# Altium schematic sheet Radar_Digital.SchDoc: Radar - Digital Board
size A3; Date: 21 / 12 / 2025; CheckedBy: João Bortolace; Author: João Bortolace; DrawnBy: João Bortolace; Engineer: João Bortolace; DocumentNumber: *1; Revision: 1.1; SheetNumber: 1; SheetTotal: 1
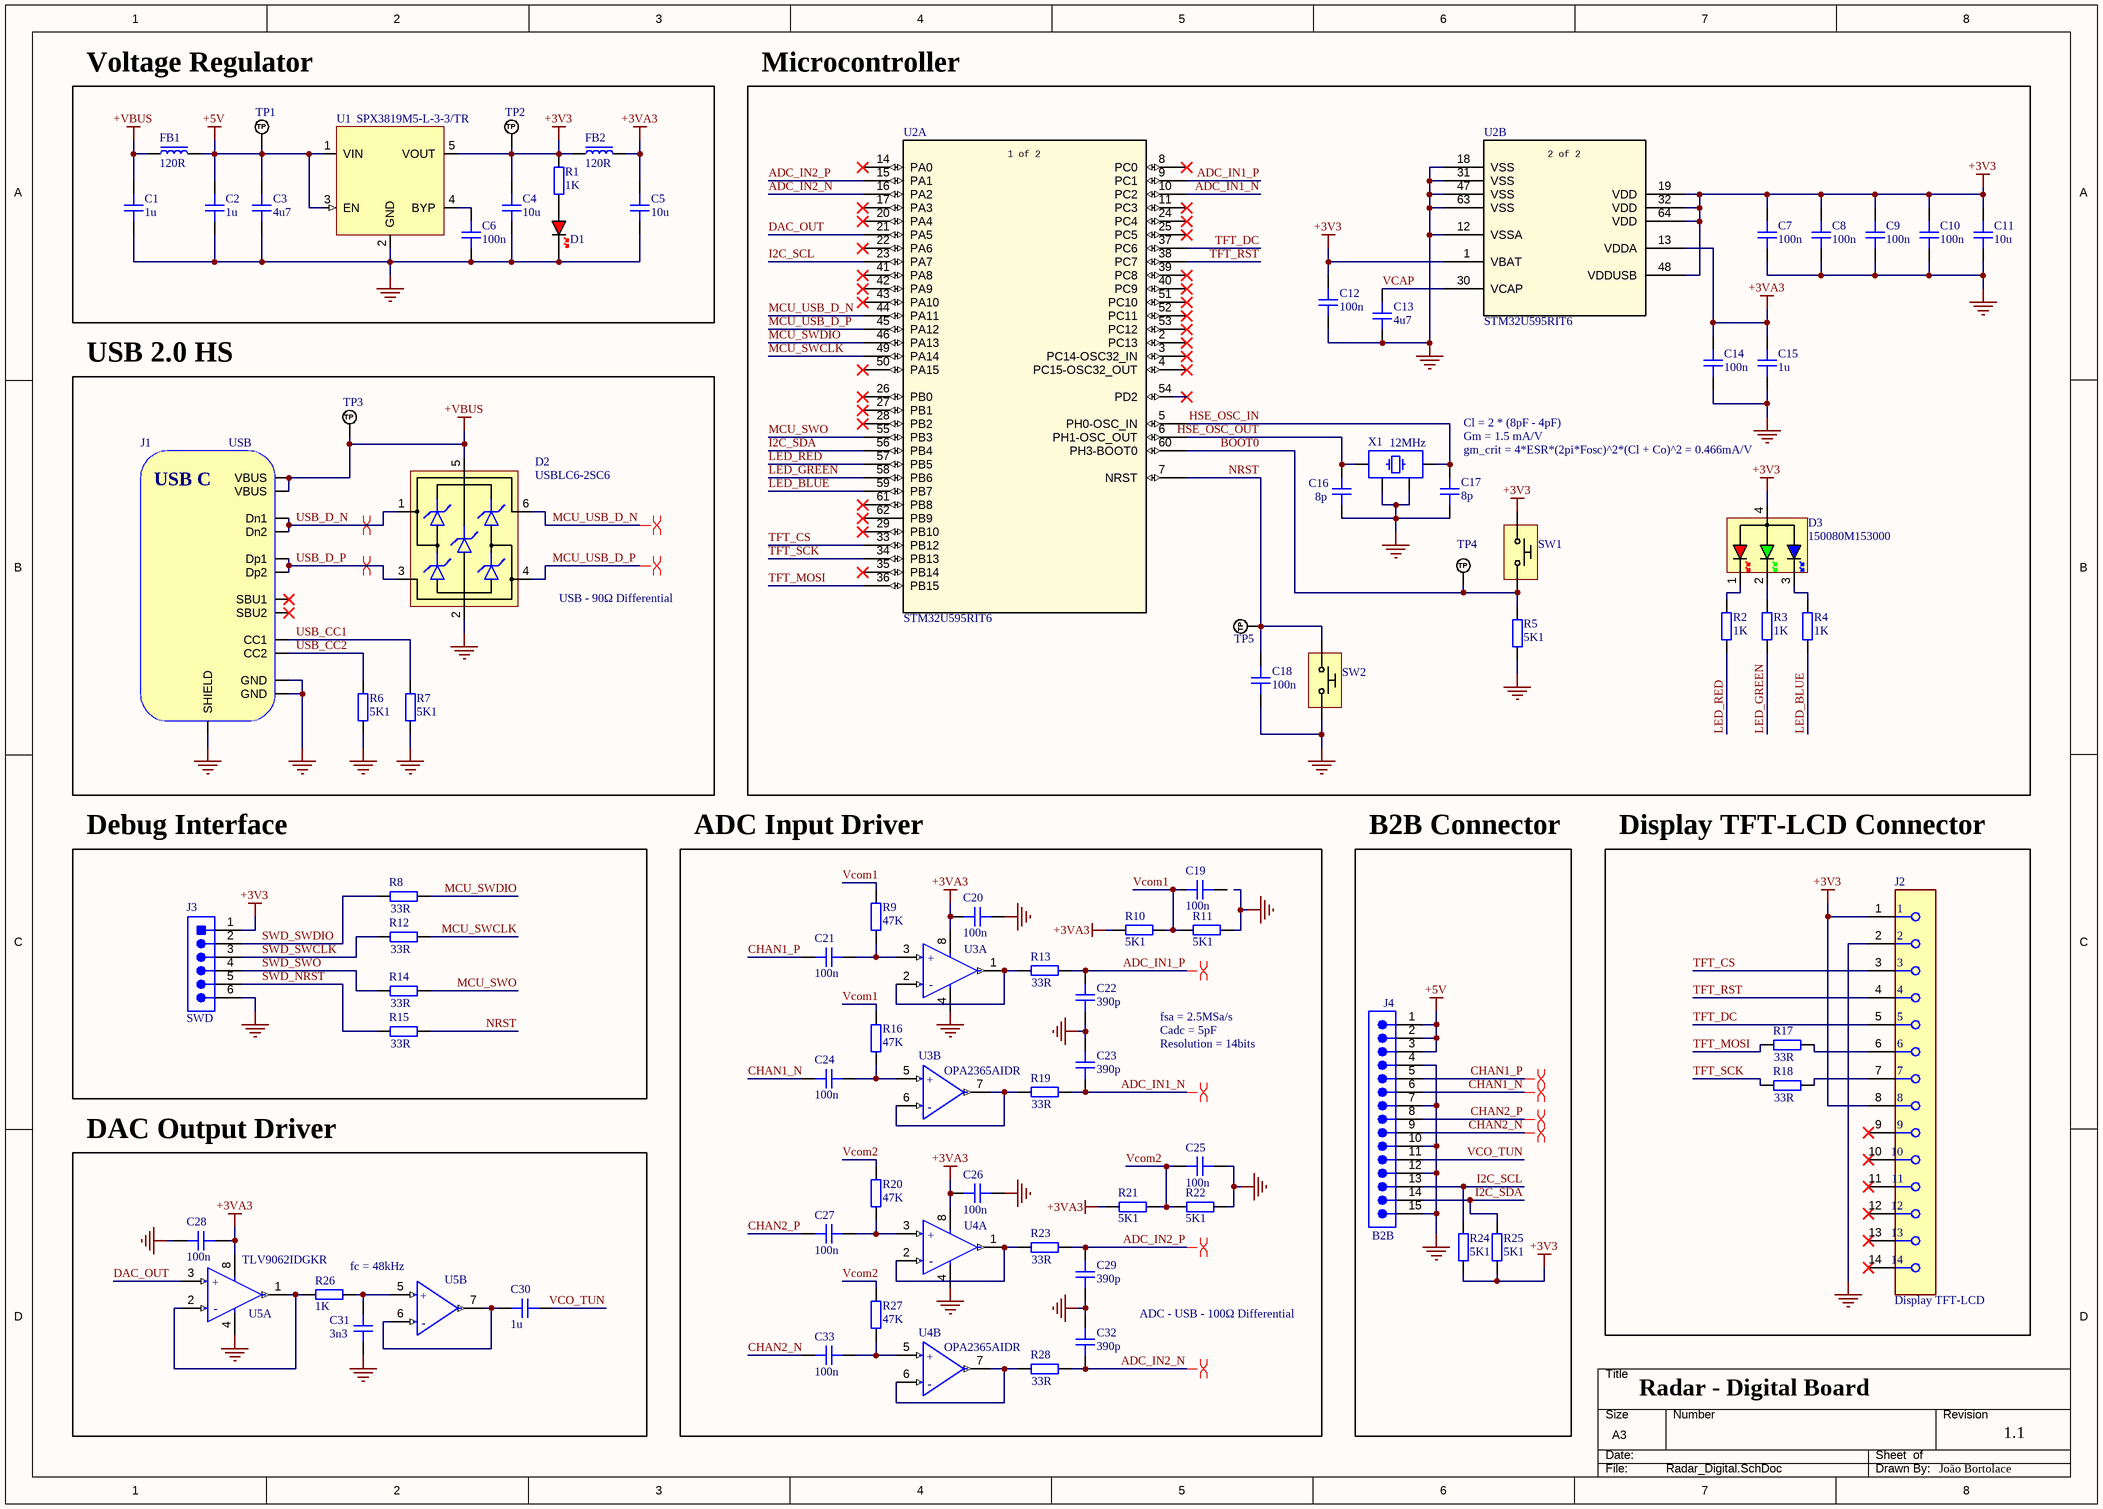
[diagram p0: Radar_Digital.SchDoc]

## Parts
C1  1u  [CAP_0603]
C2  1u  [CAP_0603]
C3  4u7  [CAP_0603]
C4  10u  [CAP_0805]
C5  10u  [CAP_0805]
C6  100n  [CAP_0603]
C7  100n  [CAP_0603]
C8  100n  [CAP_0603]
C9  100n  [CAP_0603]
C10  100n  [CAP_0603]
C11  10u  [CAP_0805]
C12  100n  [CAP_0603]
C13  4u7  [CAP_0603]
C14  100n  [CAP_0603]
C15  1u  [CAP_0603]
C16  8p  [CAP_0603]
C17  8p  [CAP_0603]
C18  100n  [CAP_0603]
C19  100n  [CAP_0603]
C20  100n  [CAP_0603]
C21  100n  [CAP_0603]
C22  390p  [CAP_0603]
C23  390p  [CAP_0603]
C24  100n  [CAP_0603]
C25  100n  [CAP_0603]
C26  100n  [CAP_0603]
C27  100n  [CAP_0603]
C28  100n  [CAP_0603]
C29  390p  [CAP_0603]
C30  1u  [CAP_0603]
C31  3n3  [CAP_0603]
C32  390p  [CAP_0603]
C33  100n  [CAP_0603]
D1  ON  [LED_0603_RED]  (value not drawn)
D2  USBLC6-2SC6  [SOT-23-6]
D3  150080M153000  [150080M153000]
FB1  120R  [FB_0603]
FB2  120R  [FB_0603]
J1  USB  [USB4105-GF-A-060]
J2  Display TFT-LCD  [FP-SSQ-114-01-G-S-MFG]  (no BOM)
J3  SWD  [SMTC-TSW-106-07-S-S_V]  (no BOM)
J4  B2B  [61301511121]  (no BOM)
R1  1K  [RES_0603]
R2  1K  [RES_0603]
R3  1K  [RES_0603]
R4  1K  [RES_0603]
R5  5K1  [RES_0603]
R6  5K1  [RES_0603]
R7  5K1  [RES_0603]
R8  33R  [RES_0603]
R9  47K  [RES_0603]
R10  5K1  [RES_0603]
R11  5K1  [RES_0603]
R12  33R  [RES_0603]
R13  33R  [RES_0603]
R14  33R  [RES_0603]
R15  33R  [RES_0603]
R16  47K  [RES_0603]
R17  33R  [RES_0603]
R18  33R  [RES_0603]
R19  33R  [RES_0603]
R20  47K  [RES_0603]
R21  5K1  [RES_0603]
R22  5K1  [RES_0603]
R23  33R  [RES_0603]
R24  5K1  [RES_0603]
R25  5K1  [RES_0603]
R26  1K  [RES_0603]
R27  47K  [RES_0603]
R28  33R  [RES_0603]
SW1  BOOT  [PTS815]  (value not drawn)
SW2  RST  [PTS815]  (value not drawn)
TP1  TP_NOBOM  [PAD_RND_1MM]  (value not drawn)  (no BOM)
TP2  TP_NOBOM  [PAD_RND_1MM]  (value not drawn)  (no BOM)
TP3  TP_NOBOM  [PAD_RND_1MM]  (value not drawn)  (no BOM)
TP4  TP_NOBOM  [PAD_RND_1MM]  (value not drawn)  (no BOM)
TP5  TP_NOBOM  [PAD_RND_1MM]  (value not drawn)  (no BOM)
U1  SPX3819M5-L-3-3/TR  [SOT-23-5]
U2  STM32U595RIT6  [LQFP64-10x10mm_STM]  (parts A,B of 2)
U3  OPA2365AIDR  [FP-D0008A-MFG]  (value not drawn)  (parts A,B of 2)
U4  OPA2365AIDR  [FP-D0008A-MFG]  (value not drawn)  (parts A,B of 2)
U5  TLV9062IDGKR  [FP-DGK0008A-IPC_A]  (parts A,B of 2)
X1  12MHz  [XTAL_3225]

## Blocks framed on the sheet
Voltage Regulator: C1-C6 D1 FB1 FB2 R1 TP1 TP2 U1
Microcontroller: C7-C18 D3 R2-R5 SW1 SW2 TP4 TP5 U2 X1
USB 2.0 HS: D2 J1 R6 R7 TP3
Debug Interface: J3 R8 R12 R14 R15
ADC Input Driver: C19-C27 C29 C32 C33 R9-R11 R13 R16 R19-R23 R27 R28 U3 U4
B2B Connector: J4 R24 R25
Display TFT-LCD Connector: J2 R17 R18
DAC Output Driver: C28 C30 C31 R26 U5

## Nets
+3V3: C4.2 C7.2 C8.2 C9.2 C10.2 C11.2 C12.2 D3.4(AC) FB2.1 J2.1 J2.8 J3.1 R1.1 R24.1 R25.1 SW1.1 TP2.1(TP) U1.5(VOUT) U2.1(VBAT) U2.19(VDD) U2.32(VDD) U2.48(VDDUSB) U2.64(VDD)
+3VA3: C5.2 C14.2 C15.2 C20.2 C26.2 C28.2 FB2.2 R10.2 R21.2 U2.13(VDDA) U3.8(V+) U4.8(V+) U5.8(V+)
+5V: C2.2 C3.2 FB1.2 J4.1 J4.2 J4.3 TP1.1(TP) U1.1(VIN) U1.3(EN)
+VBUS: C1.2 D2.5(VBUS) FB1.1 J1.A4B9(VBUS) J1.B4A9(VBUS) TP3.1(TP)
GND: C1.1 C2.1 C3.1 C4.1 C5.1 C6.1 C7.1 C8.1 C9.1 C10.1 C11.1 C12.1 C13.1 C14.1 C15.1 C16.1 C17.1 C18.1 C20.1 C22.1 C23.2 C25.1 C26.1 C28.1 C29.1 C31.1 C32.2 D1.K D2.2(GND) J1.A1B12(GND) J1.B1A12(GND) J1.SH(SHIELD) J2.2 J3.6 J4.4 J4.7 J4.10 J4.12 J4.15 R5.1 R6.1 R7.1 R11.1 R22.1 SW2.2 U1.2(GND) U2.12(VSSA) U2.18(VSS) U2.31(VSS) U2.47(VSS) U2.63(VSS) U3.4(V-) U4.4(V-) U5.4(V-) X1.2 X1.4
ADC_IN1_N: C23.1 R19.2 U2.10(PC2)
ADC_IN1_P: C22.2 R13.2 U2.9(PC1)
ADC_IN2_N: C32.1 R28.2 U2.16(PA2)
ADC_IN2_P: C29.2 R23.2 U2.15(PA1)
BOOT0: R5.2 SW1.2 TP4.1(TP) U2.60(PH3-BOOT0)
CHAN1_N: C24.2 J4.6
CHAN1_P: C21.2 J4.5
CHAN2_N: C33.2 J4.9
CHAN2_P: C27.2 J4.8
DAC_OUT: U2.21(PA5) U5.3(IN1+)
HSE_OSC_IN: C17.2 U2.5(PH0-OSC_IN) X1.3
HSE_OSC_OUT: C16.2 U2.6(PH1-OSC_OUT) X1.1
I2C_SCL: J4.13 R24.2 U2.23(PA7)
I2C_SDA: J4.14 R25.2 U2.56(PB4)
LED_BLUE: R4.2 U2.59(PB7)
LED_GREEN: R3.2 U2.58(PB6)
LED_RED: R2.2 U2.57(PB5)
MCU_SWCLK: R12.2 U2.49(PA14)
MCU_SWDIO: R8.2 U2.46(PA13)
MCU_SWO: R14.2 U2.55(PB3)
MCU_USB_D_N: D2.6(IO1) U2.44(PA11)
MCU_USB_D_P: D2.4(IO2) U2.45(PA12)
NRST: C18.2 R15.2 SW2.1 TP5.1(TP) U2.7(NRST)
SWD_NRST: J3.5 R15.1
SWD_SWCLK: J3.3 R12.1
SWD_SWDIO: J3.2 R8.1
SWD_SWO: J3.4 R14.1
TFT_CS: J2.3 U2.33(PB12)
TFT_DC: J2.5 U2.37(PC6)
TFT_MOSI: R17.1 U2.36(PB15)
TFT_RST: J2.4 U2.38(PC7)
TFT_SCK: R18.1 U2.34(PB13)
USB_CC1: J1.A5(CC1) R7.2
USB_CC2: J1.B5(CC2) R6.2
USB_D_N: D2.1(IO1) J1.A7(Dn1) J1.B7(Dn2)
USB_D_P: D2.3(IO2) J1.A6(Dp1) J1.B6(Dp2)
VCAP: C13.2 U2.30(VCAP)
VCO_TUN: C30.1 J4.11
Vcom1: C19.2 R9.2 R10.1 R11.2 R16.2
Vcom2: C25.2 R20.2 R21.1 R22.2 R27.2
NetC6_2: C6.2 U1.4(BYP)
NetC21_1: C21.1 R9.1 U3.3(IN_A+)
NetC24_1: C24.1 R16.1 U3.5(IN_B+)
NetC27_1: C27.1 R20.1 U4.3(IN_A+)
NetC30_2: C30.2 U5.6(IN2-) U5.7(OUT2)
NetC31_2: C31.2 R26.2 U5.5(IN2+)
NetC33_1: C33.1 R27.1 U4.5(IN_B+)
NetD1_A: D1.A R1.2
NetD3_1: D3.1(CR) R2.1
NetD3_2: D3.2(CG) R3.1
NetD3_3: D3.3(CB) R4.1
NetJ2_6: J2.6 R17.2
NetJ2_7: J2.7 R18.2
NetR13_1: R13.1 U3.1(VOUTA) U3.2(IN_A-)
NetR19_1: R19.1 U3.6(IN_B-) U3.7(VOUTB)
NetR23_1: R23.1 U4.1(VOUTA) U4.2(IN_A-)
NetR26_1: R26.1 U5.1(OUT1) U5.2(IN1-)
NetR28_1: R28.1 U4.6(IN_B-) U4.7(VOUTB)

Not connected (* = marked no-connect by the designer): C19 1; J1 A8(SBU1)* B8(SBU2)*; J2 9* 10* 11* 12* 13* 14*; U2 2(PC13)* 3(PC14-OSC32_IN)* 4(PC15-OSC32_OUT)* 8(PC0)* 11(PC3)* 14(PA0)* 17(PA3)* 20(PA4)* 22(PA6)* 24(PC4)* 25(PC5)* 26(PB0)* 27(PB1)* 28(PB2)* 29(PB10)* 35(PB14)* 39(PC8)* 40(PC9)* 41(PA8)* 42(PA9)* 43(PA10)* 50(PA15)* 51(PC10)* 52(PC11)* 53(PC12)* 54(PD2)* 61(PB8)* 62(PB9)*

## Layout directives
differential pair; net class USB_DIFF: MCU_USB_D_N, MCU_USB_D_P, USB_D_N, USB_D_P
differential pair; net class ADC_DIFF: ADC_IN1_N, ADC_IN1_P, ADC_IN2_N, ADC_IN2_P, CHAN1_N, CHAN1_P, CHAN2_N, CHAN2_P

## Notes on the sheet
- Cl = 2 * (8pF - 4pF)
- (near C17) gm_crit = 4*ESR*(2pi*Fosc)^2*(Cl + Co)^2 = 0.466mA/V
- Gm = 1.5 mA/V
- (near D2) USB - 90Ω Differential
- fsa = 2.5MSa/s
- Cadc = 5pF
- Resolution = 14bits
- fc = 48kHz
- ADC - USB - 100Ω Differential
- DWG. NO.
- REV.
- SHT.
- THIS DOCUMENT AND THE DATA DISCLOSED HEREIN OR HEREWITH IS THE PROPERTY OF ALTIUM LIMITED AND MAY BE FREELY DISTRIBUTED IN WHOLE. NO RIGHTS ARE RESERVED OR EXPRESS OR IMPLIED WARANTEE GIVEN.
- REVISION
- DESCRIPTION
- DATE
- APPROVED
- ENG:
- APPROVALS
- PROJECT
- DSN:
- CHK:
- REFERENCE DOCUMENTS
- PROJECT REVISION:
- TITLE
- DOCUMENT REVISION:
- DESIGN ITEM:
- BOM:
- FAB DWG:
- PCB DWG:
- ASSY DWG:
- SCALE:
- SIZE
- B
- CAGE CODE
- FILE NAME
- DWG NO.
- SHEET
- OF
- REV
- (in symbol CMP-0272-00746-4, part A) +; -
- (in symbol CMP-0272-00746-4, part B) +; -
- (in symbol CMP-04895-000256-1, part A) +; -
- (in symbol CMP-04895-000256-1, part B) +; -
- (in symbol STM32U595RIT6, part A) 1 of 2
- (in symbol STM32U595RIT6, part B) 2 of 2
- (in symbol USB4105-GF-A-060) USB C

## Library data of the parts
C1 C2 C15 C30 = CAP_0603: 1uF ±10% 25V Ceramic Capacitor X7R 0603; Manufacturer: Samsung Electro-Mechanics; Manufacturer Part Number: CL10B105KA8NNNC; Distributor Link: https://www.lcsc.com/product-detail/C29936.html?s_z=n_C29936; LCSC: C29936; Rating: 25V; Dielectric: X7R
C3 C13 = CAP_0603: 4.7uF ±10% 25V Ceramic Capacitor X5R 0603; Manufacturer: Samsung Electro-Mechanics; Manufacturer Part Number: CL10A475KA8NQNC; Distributor Link: https://www.lcsc.com/product-detail/C69335.html?s_z=n_C69335; LCSC: C69335; Rating: 25V; Dielectric: X5R
C4 C5 C11 = CAP_0805: 10uF ±10% 16V Ceramic Capacitor X7R 0805; Manufacturer: Samsung Electro-Mechanics; Manufacturer Part Number: CL21B106KOQNNNE; Distributor Link: https://www.lcsc.com/product-detail/C95841.html?s_z=n_C95841; LCSC: C95841; Rating: 16V; Dielectric: X7R
C6-C10 C12 C14 C18-C21 C24-C28 C33 = CAP_0603: 100nF ±10% 50V Ceramic Capacitor X7R 0603; Manufacturer: Samsung Electro-Mechanics; Manufacturer Part Number: CL10B104KB8NNNC; Distributor Link: https://www.lcsc.com/product-detail/C1591.html?s_z=n_C1591; LCSC: C1591; Rating: 50V; Dielectric: X7R
C16 C17 = CAP_0603: 8pF 50V Ceramic Capacitor NP0 0603; Manufacturer: YAGEO; Manufacturer Part Number: CC0603CRNPO9BN8R0; Distributor Link: https://www.lcsc.com/product-detail/C327316.html?s_z=n_capacitor%25208p%25200603; LCSC: C327316; Rating: 50V; Dielectric: NP0
C22 C23 C29 C32 = CAP_0603: 390pF ±5% 50V Ceramic Capacitor C0G 0603; Manufacturer: muRata; Manufacturer Part Number: GRM1885C1H391JA01D; Distributor Link: https://www.lcsc.com/product-detail/C701309.html?s_z=n_C701309; LCSC: C701309; Rating: 50V; Dielectric: C0G
C31 = CAP_0603: 3.3nF ±10% 50V Ceramic Capacitor X7R 0603; Manufacturer: Samsung Electro-Mechanics; Manufacturer Part Number: CL10B332KB8NNNC; Distributor Link: https://www.lcsc.com/product-detail/C1613.html?s_z=n_capacitor%25203.3n%25200603; LCSC: C1613; Rating: 50V; Dielectric: X7R
D1 = LED_0603_RED: Red 625nm LED Indication - Discrete 2.3V 0603; Manufacturer: XINGLIGHT; Manufacturer Part Number: XL-1608SURC-06; LCSC: C965799
D2 = USBLC6-2SC6: Low-Capacitance ESD Protection USB; Manufacturer: STMicroelectronics; Manufacturer Part Number: USBLC6-2SC6; Distributor Link: https://www.mouser.de/ProductDetail/STMicroelectronics/USBLC6-2SC6?qs=po45yt2pPpu%2FhNIlwQdTlg%3D%3D; LCSC: C7519
D3 = 150080M153000: Water Clear SMD-4P,2x1.2mm LED Indication - Discrete RoHS; Manufacturer: XINGLIGHT; Manufacturer Part Number: XL-2012RGBC; Distributor Link: https://www.lcsc.com/product-detail/C965848.html?s_z=n_C965848; LCSC: C965848
FB1 FB2 = FB_0603: 120Ω@100MHz 1 Line Ferrite Bead 0603 2A 50mΩ; Manufacturer: muRata; Manufacturer Part Number: BLM18PG121SN1D; Distributor Link: https://www.lcsc.com/product-detail/C14709.html?s_z=n_C14709; LCSC: C14709
J1 = USB4105-GF-A-060: USB-C (USB TYPE-C) Receptacle Connector 16 Position Surface Mount, Right Angle; Manufacturer: SHOU HAN; Manufacturer Part Number: TYPE-C 16PIN 2MD(073); Distributor Link: https://www.lcsc.com/product-detail/C2765186.html?s_z=n_C2765186; LCSC: C2765186
J2 = CMP-02766-001401-1: CONN RCPT 14POS 0.1 GOLD PCB; Gender: Receptacle; Voltage Rating: 550V; Number of Contacts: 14; Contact Resistance: 10mR; Max Current Rating: 7.6A; Pitch: 2.54mm; Termination: Solder; Color: Black; Housing Color: Black; Packaging: Bulk; Radiation Hardening: No; REACH SVHC: No SVHC; Max Voltage Rating (AC): 550V; Depth: 2.41mm; Min Operating Temperature: -55°C; Contact Material: Bronze; Orientation: Straight; Number of Positions: 14; Contact Plating: Gold; RoHS Compliant: Yes; Lead Free: Lead Free; Length: 36.07mm; Mount: Through Hole; Connector Type: Receptacle; Contact Type: Female Socket; Max Operating Temperature: 125°C; Number of Rows: 1; Series: SSQ; Current Rating: 7.6A; Housing Material: Polymer
J3 = CMP-1681-00007-2: Male Header, Pitch 2.54 mm, 1 x 6 Position, Height 8.38 mm, Tail Length 2.54 mm, -55 to 125 degC, RoHS, Bulk; Manufacturer: Samtec; Rows: 1; Contact Finish: Gold; Lead Pitch: 0.1 inch; Package Quantity: 1; Mounting Technology: Through Hole; ComponentLink1Description: Manufacturer URL; Contact Plating: Gold; DatasheetVersion: 12/2015; ComponentLink3Description: Package Specification; PackageDescription: Male Header, Pitch 2.54 mm, 1 x 6 Position, Height 8.38 mm, Tail Length 2.54 mm; Height: 8.38 mm; ComponentLink2Description: Datasheet; RoHSCompliant: true; Colour: Black; Packaging: Bulk; Min Operating Temperature: -55 degC; ComponentLink2URL: http://suddendocs.samtec.com/catalog_english/tsw_th.pdf; Mount: Through Hole; PackageReference: TSW-102-07-S-S; Pins: 6; Max Operating Temperature: 125 degC; ComponentLink3URL: http://suddendocs.samtec.com/prints/tsw-xxx-xx-x-x-xx-xxx-footprint.pdf; Length: 15.24 mm; Contact Material: Bronze; ComponentLink1URL: http://www.samtec.com/
J4 = CMP-207987-000006-4: Conn Unshrouded Header HDR 15 POS 2.54mm Solder ST Top Entry Thru-Hole Bag; Number of Positions: 15; Connector Type: Male Pin; Current Rating: 3A; Gender: Male; Voltage Rating: 250V; Mount: Through Hole; Color: Black; Termination: Solder; Max Operating Temperature: 105°C; RoHS: Compliant; Contact Mating Length: 5.9944mm; Min Operating Temperature: -40°C; Height: 8.89mm; Pitch: 2.54mm; Number of Contacts: 15; Contact Material: Gold; Number of Rows: 1; Packaging: Bulk; Contact Plating: Gold
R1-R4 R26 = RES_0603: 100mW 1kΩ 75V Thick Film Resistor ±100ppm/℃ ±1% 0603 Chip Resistor - Surface Mount RoHS; Manufacturer: YAGEO; Manufacturer Part Number: RC0603FR-071KL; LCSC: C22548
  R1-R4: Distributor Link: https://www.lcsc.com/product-detail/C22548.html?s_z=n_RC0603FR-071KL
  R26: Distributor Link: *
R5-R7 R10 R11 R21 R22 R24 R25 = RES_0603: 100mW 5.1kΩ 75V Thick Film Resistor ±100ppm/℃ ±1% 0603 Chip Resistor - Surface Mount RoHS; Manufacturer: YAGEO; Manufacturer Part Number: RC0603FR-075K1L; Distributor Link: https://www.lcsc.com/product-detail/C105580.html?s_z=n_C105580; LCSC: C105580
R8 R12-R15 R17-R19 R23 R28 = RES_0603: 100mW 33Ω 75V Thick Film Resistor ±100ppm/℃ ±1% 0603 Chip Resistor - Surface Mount RoHS; Manufacturer: YAGEO; Manufacturer Part Number: RC0603FR-0733RL; Distributor Link: https://www.lcsc.com/product-detail/C108661.html?s_z=n_C108661; LCSC: C108661
R9 R16 R20 R27 = RES_0603: 100mW 47kΩ 75V Thick Film Resistor ±100ppm/℃ ±1% 0603 Chip Resistor - Surface Mount RoHS; Manufacturer: YAGEO; Manufacturer Part Number: RC0603FR-0747KL; Distributor Link: https://www.lcsc.com/product-detail/C105579.html?s_z=n_C105579; LCSC: C105579
SW1 SW2 = PTS815-SJM-250-SMTR-LFS: Tactile Switch SPST 400gf 2.5mm 4.2mm x 3.2mm Surface Mount; Manufacturer: G-Switch; Manufacturer Part Number: GT-TC048D-H025-L1; LCSC: C843674
TP1-TP5 = TEST_POINT_RND_1MM: Test Point Round 1mm (NO BOM)
U1 = SPX3819M5-L-3-3/TR: 500mA +3.3V Low-Noise LDO Voltage Regulator; Manufacturer: MaxLinear; Manufacturer Part Number: SPX3819M5-L-3-3/TR; Distributor Link: https://www.lcsc.com/product-detail/C9055.html?s_z=n_SPX3819M5; LCSC: C9055
U2 = STM32U595RIT6: Ultra-low-power with FPU Arm Cortex-M33 MCU with TrustZone, 160 MHz with 2 Mbytes of Flash memory; Manufacturer: STMicroelectronics; Copyright: Copyright (C) 2025 Ultra Librarian. All rights reserved.; Manufacturer Part Number: STM32U595RIT6; Datasheet: https://www.st.com/resource/en/datasheet/stm32u595ai.pdf; RefDes: RefDes; Type: Type; Supplier 1: LCSC; Supplier Part Number 1: C28247611; Supplier Unit Price 1: 20.63; LCSC: C28247611
U3 U4 = CMP-0272-00746-4: IC OPAMP GP 2 CIRCUIT 8SOIC; Manufacturer: TI; Max Supply Voltage: 5.5V; Input Offset Voltage (Vos): 200uV; Output Current per Channel: 65mA; Operating Supply Current: 4.6mA; Number of Amplifiers: 2; Slew Rate: 25V/µs; Gain Bandwidth Product: 50MHz; Common Mode Rejection Ratio: 100dB; Nominal Supply Current: 5mA; Voltage Gain: 120dB; Input Bias Current: 10pA; Min Supply Voltage: 2.2V; Case/Package: D; Package Quantity: 1; Radiation Hardening: No; Packaging: Tape and Reel; Number of Circuits: 2; Output Current: 65mA; Contact Plating: Gold; Power Supply Rejection Ratio (PSRR): 100dB; Unity Gain Bandwidth Product: 50MHz; Max Operating Temperature: 125°C; REACH SVHC: No SVHC; Max I/O Voltage: 200uV; Min Operating Temperature: -40°C; Number of Elements: 2; Lead Free: Lead Free; Bandwidth: 50MHz; Number of Channels: 2; Number of Pins: 8; Manufacturer Part Number: OPA2365AIDR; Distributor Link: https://www.lcsc.com/product-detail/C130011.html?s_z=n_OPA2365AIDR; LCSC: C130011
U5 = CMP-04895-000256-1: IC CMOS 2 CIRCUIT 8VSSOP; Manufacturer: TI; Circuit Type: Isolated; Operating Supply Current: 538uA; Tolerance: 0.1%; Temperature Coefficient: 10ppm/°C; Input Bias Current: 0.5pA; Gain Bandwidth Product: 10MHz; Slew Rate: 6.5V/µs; Power Per Element: 125mW; Input Offset Voltage (Vos): 300uV; Output Current per Channel: 50mA; Resistance: 20kR; Number of Circuits: 2; Number of Resistors: 4; Packaging: Cut Tape; Mount: Surface Mount; Case/Package: VSSOP; Case Code (Imperial): 1206; Max Operating Temperature: 125°C; Number of Pins: 8; RoHS Compliant: Yes; Case Code (Metric): 3216; Number of Channels: 2; Min Operating Temperature: -40°C; Manufacturer Part Number: TLV9062IDGKR; Distributor Link: https://www.lcsc.com/product-detail/C398356.html?s_z=n_TLV9062IDGKR; LCSC: C398356
X1 = TSX-3225_24.0000MF15X-AC: Crystal 12MHz ±15ppm 8pF 120Ω SMD3225-4P; Manufacturer: DIODES; Manufacturer Part Number: FL1200138; LCSC: C526612; Part Link: https://www.lcsc.com/product-detail/C526612.html?s_z=n_Crystal%252012MHz%2520%25C2%25B110ppm%25208pF%2520120%25CE%25A9%2520SMD3225-4P